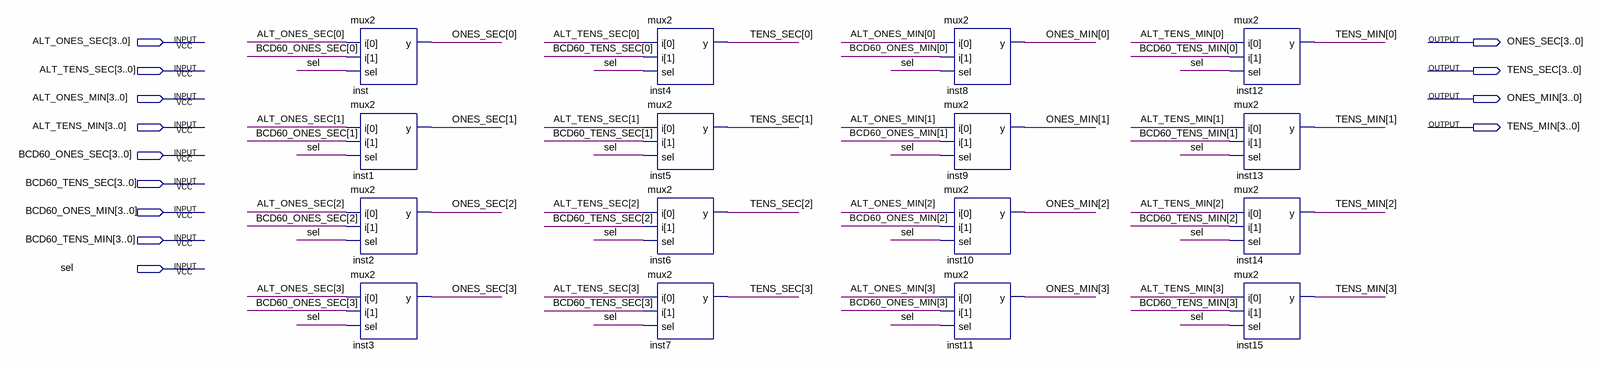
[diagram p0: schematic sheet]
// Quartus schematic HEX_Mux.bdf as structural Verilog: 16 symbols, 13 pins
module HEX_Mux (
  input  [3:0] ALT_ONES_SEC,
  input  [3:0] ALT_TENS_SEC,
  input  [3:0] ALT_ONES_MIN,
  input  [3:0] ALT_TENS_MIN,
  input  [3:0] BCD60_ONES_SEC,
  input  [3:0] BCD60_TENS_SEC,
  input  [3:0] BCD60_ONES_MIN,
  input  [3:0] BCD60_TENS_MIN,
  input  sel,
  output [3:0] ONES_SEC,
  output [3:0] TENS_SEC,
  output [3:0] ONES_MIN,
  output [3:0] TENS_MIN
);

  mux2 inst (.i({BCD60_ONES_SEC[0], ALT_ONES_SEC[0]}), .sel(sel), .y(ONES_SEC[0]));
  mux2 inst1 (.i({BCD60_ONES_SEC[1], ALT_ONES_SEC[1]}), .sel(sel), .y(ONES_SEC[1]));
  mux2 inst2 (.i({BCD60_ONES_SEC[2], ALT_ONES_SEC[2]}), .sel(sel), .y(ONES_SEC[2]));
  mux2 inst3 (.i({BCD60_ONES_SEC[3], ALT_ONES_SEC[3]}), .sel(sel), .y(ONES_SEC[3]));
  mux2 inst4 (.i({BCD60_TENS_SEC[0], ALT_TENS_SEC[0]}), .sel(sel), .y(TENS_SEC[0]));
  mux2 inst5 (.i({BCD60_TENS_SEC[1], ALT_TENS_SEC[1]}), .sel(sel), .y(TENS_SEC[1]));
  mux2 inst6 (.i({BCD60_TENS_SEC[2], ALT_TENS_SEC[2]}), .sel(sel), .y(TENS_SEC[2]));
  mux2 inst7 (.i({BCD60_TENS_SEC[3], ALT_TENS_SEC[3]}), .sel(sel), .y(TENS_SEC[3]));
  mux2 inst8 (.i({BCD60_ONES_MIN[0], ALT_ONES_MIN[0]}), .sel(sel), .y(ONES_MIN[0]));
  mux2 inst9 (.i({BCD60_ONES_MIN[1], ALT_ONES_MIN[1]}), .sel(sel), .y(ONES_MIN[1]));
  mux2 inst10 (.i({BCD60_ONES_MIN[2], ALT_ONES_MIN[2]}), .sel(sel), .y(ONES_MIN[2]));
  mux2 inst11 (.i({BCD60_ONES_MIN[3], ALT_ONES_MIN[3]}), .sel(sel), .y(ONES_MIN[3]));
  mux2 inst12 (.i({BCD60_TENS_MIN[0], ALT_TENS_MIN[0]}), .sel(sel), .y(TENS_MIN[0]));
  mux2 inst13 (.i({BCD60_TENS_MIN[1], ALT_TENS_MIN[1]}), .sel(sel), .y(TENS_MIN[1]));
  mux2 inst14 (.i({BCD60_TENS_MIN[2], ALT_TENS_MIN[2]}), .sel(sel), .y(TENS_MIN[2]));
  mux2 inst15 (.i({BCD60_TENS_MIN[3], ALT_TENS_MIN[3]}), .sel(sel), .y(TENS_MIN[3]));
endmodule
